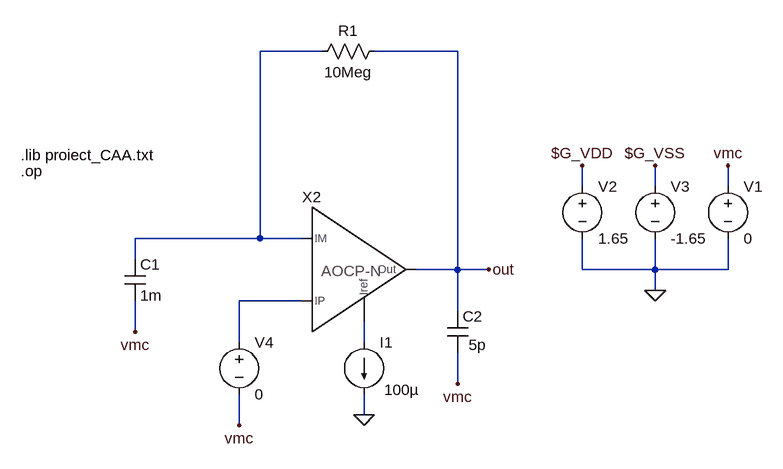
[diagram p0: schematic test_ao_cp_n_OP.asc]
test_ao_cp_n_OP.asc, the LTspice schematic file:
Version 4
SHEET 1 1600 816
WIRE 592 96 496 96
WIRE 800 96 672 96
WIRE 992 304 992 272
WIRE 1104 304 1104 272
WIRE 1216 304 1216 272
WIRE 496 384 496 96
WIRE 496 384 304 384
WIRE 560 384 496 384
WIRE 304 416 304 384
WIRE 800 432 800 96
WIRE 800 432 736 432
WIRE 848 432 800 432
WIRE 992 432 992 384
WIRE 1104 432 1104 384
WIRE 1104 432 992 432
WIRE 1216 432 1216 384
WIRE 1216 432 1104 432
WIRE 1104 464 1104 432
WIRE 560 480 464 480
WIRE 800 496 800 432
WIRE 304 528 304 480
WIRE 464 544 464 480
WIRE 656 544 656 512
WIRE 800 608 800 560
WIRE 656 656 656 624
WIRE 464 672 464 624
FLAG 1104 464 0
FLAG 992 272 $G_VDD
FLAG 1104 272 $G_VSS
FLAG 1216 272 vmc
FLAG 304 528 vmc
FLAG 848 432 out
FLAG 464 672 vmc
FLAG 800 608 vmc
FLAG 656 656 0
SYMBOL voltage 992 288 R0
WINDOW 123 0 0 Left 2
WINDOW 39 0 0 Left 2
SYMATTR InstName V2
SYMATTR Value 1.65
SYMBOL voltage 1104 288 R0
WINDOW 123 0 0 Left 2
WINDOW 39 0 0 Left 2
SYMATTR InstName V3
SYMATTR Value -1.65
SYMBOL voltage 1216 288 R0
WINDOW 123 0 0 Left 2
WINDOW 39 0 0 Left 2
SYMATTR InstName V1
SYMATTR Value 0
SYMBOL res 688 80 R90
WINDOW 0 0 56 VBottom 2
WINDOW 3 32 56 VTop 2
SYMATTR InstName R1
SYMATTR Value 10Meg
SYMBOL cap 288 416 R0
SYMATTR InstName C1
SYMATTR Value 1m
SYMBOL current 656 544 R0
WINDOW 123 0 0 Left 2
WINDOW 39 0 0 Left 2
WINDOW 3 31 73 Left 2
SYMATTR Value 100µ
SYMATTR InstName I1
SYMBOL cap 784 496 R0
WINDOW 3 33 52 Left 2
SYMATTR Value 5p
SYMATTR InstName C2
SYMBOL voltage 464 528 R0
WINDOW 123 0 0 Left 2
WINDOW 39 0 0 Left 2
SYMATTR InstName V4
SYMATTR Value 0
SYMBOL ao_cp_n 608 432 R0
SYMATTR InstName X2
TEXT 128 256 Left 2 !.lib proiect_CAA.txt
TEXT 128 280 Left 2 !.op

The netlist it stands for:
* test_ao_cp_n_OP.asc
V2 $G_VDD 0 1.65
V3 $G_VSS 0 -1.65
V1 vmc 0 0
R1 out N001 10Meg
C1 N001 vmc 1m
I1 N003 0 100µ
C2 out vmc 5p
V4 N002 vmc 0
XX2 N001 N002 out N003 ao_cp_n  ; pins IM IP Out Iref
.lib proiect_CAA.txt
.op
.backanno
.end